# EAGLE schematic TDA7419 (EAGLE 7.5.0)
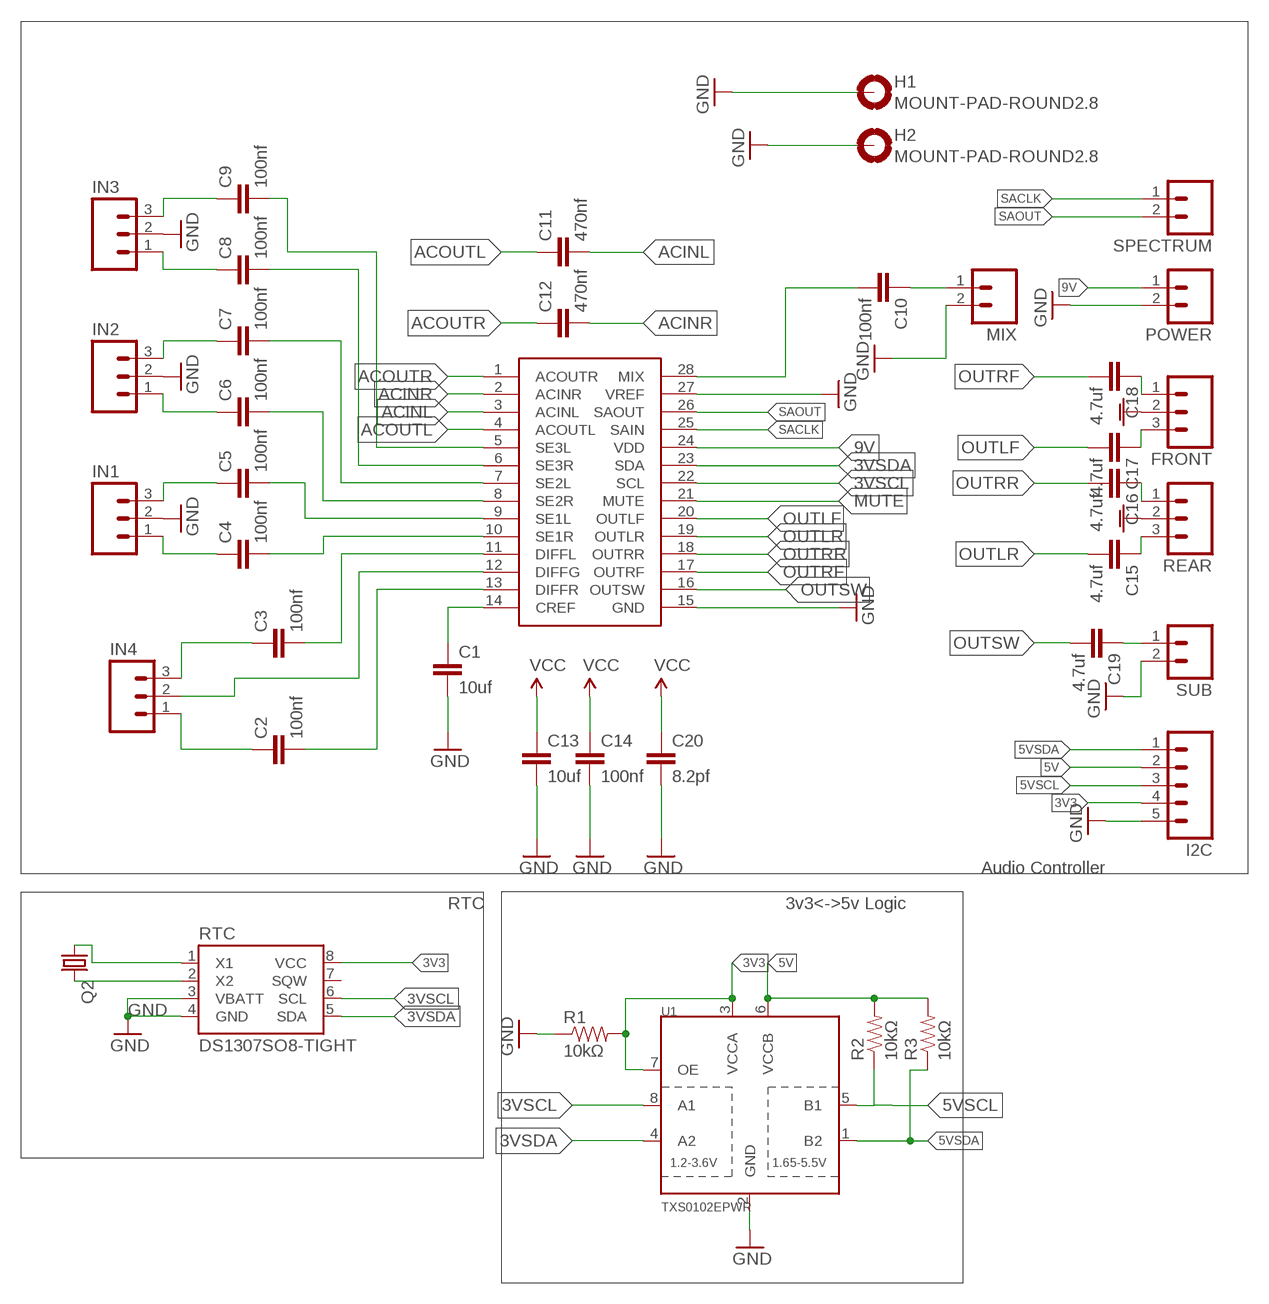
[diagram p0: schematic, sheet 1]

## Parts
C1  10uf  0603CAP  [0603-CAP]
C2  100nf  0603CAP  [0603-CAP]
C3  100nf  0603CAP  [0603-CAP]
C4  100nf  0603CAP  [0603-CAP]
C5  100nf  0603CAP  [0603-CAP]
C6  100nf  0603CAP  [0603-CAP]
C7  100nf  0603CAP  [0603-CAP]
C8  100nf  0603CAP  [0603-CAP]
C9  100nf  0603CAP  [0603-CAP]
C10  100nf  0603CAP  [0603-CAP]
C11  470nf  0603CAP  [0603-CAP]
C12  470nf  0603CAP  [0603-CAP]
C13  10uf  0603CAP  [0603-CAP]
C14  100nf  0603CAP  [0603-CAP]
C15  4.7uf  0603CAP  [0603-CAP]
C16  4.7uf  0603CAP  [0603-CAP]
C17  4.7uf  0603CAP  [0603-CAP]
C18  4.7uf  0603CAP  [0603-CAP]
C19  4.7uf  0603CAP  [0603-CAP]
C20  8.2pf  0603CAP  [0603-CAP]
FRONT  M03PTH  [1X03]
H1  MOUNT-PAD-ROUND2.8  [2,8-PAD]
H2  MOUNT-PAD-ROUND2.8  [2,8-PAD]
I2C  M05  [05P]
IN1  M03  [03P]
IN2  M03  [03P]
IN3  M03  [03P]
IN4  M03  [03P]
MIX  M02  [02P]
POWER  M02  [02P]
Q2  CRYSTALTC26H_EZ  [TC26HEZ]
R1  10kΩ  RESISTOR0603  [0603-RES]
R2  10kΩ  RESISTOR0603  [0603-RES]
R3  10kΩ  RESISTOR0603  [0603-RES]
REAR  M03PTH  [1X03]
RTC  DS1307SO8-TIGHT  [SO08-TIGHT]
SPECTRUM  M02  [02P]
SUB  M02  [02P]
TDA  TDA7419  [SOIC-28]
U1  TXS0102EPWR  [TSSOP8]

## Nets
3V3: I2C.4 R1.2 RTC.8(VCC) U1.3(VCCA) U1.7(OE)
3VSCL: RTC.6(SCL) TDA.22(SCL) U1.8(A1)
3VSDA: RTC.5(SDA) TDA.23(SDA) U1.4(A2)
5V: I2C.2 R2.2 R3.2 U1.6(VCCB)
5VSCL: I2C.3 R2.1 U1.5(B1)
5VSDA: I2C.1 R3.1 U1.1(B2)
9V: C13.1 C14.1 C20.1 POWER.1 TDA.24(VDD) ; supply symbol labelled VCC
ACINL: C11.2 TDA.3(ACINL)
ACINR: C12.2 TDA.2(ACINR)
ACOUTL: C11.1 TDA.4(ACOUTL)
ACOUTR: C12.1 TDA.1(ACOUTR)
CREF: C1.1 TDA.14(CREF)
DIFFG: IN4.2 TDA.12(DIFFG)
DIFFL: C3.2 TDA.11(DIFFL)
DIFFR: C2.2 TDA.13(DIFFR)
GND: C1.2 C13.2 C14.2 C20.2 FRONT.2 H1.B2,8(MOUNT) H2.B2,8(MOUNT) I2C.5 IN1.2 IN2.2 IN3.2 MIX.2 POWER.2 R1.1 REAR.2 RTC.3(VBATT) RTC.4(GND) SUB.2 TDA.15(GND) TDA.27(VREF) U1.2(GND) ; supply symbol labelled AGND
MIX: C10.2 TDA.28(MIX)
MUTE: TDA.21(MUTE)
N$1: C10.1 MIX.1
N$4: C9.1 IN3.3
N$5: C8.1 IN3.1
N$6: C7.1 IN2.3
N$7: C6.1 IN2.1
N$8: C5.1 IN1.3
N$9: C4.1 IN1.1
N$10: C3.1 IN4.3
N$11: C2.1 IN4.1
N$17: C18.1 FRONT.1
N$18: C17.1 FRONT.3
N$19: C16.1 REAR.1
N$20: C15.1 REAR.3
N$21: C19.1 SUB.1
N$25: Q2.2 RTC.2(X2)
N$30: Q2.1 RTC.1(X1)
OUTLF: C17.2 TDA.20(OUTLF)
OUTLR: C15.2 TDA.19(OUTLR)
OUTRF: C18.2 TDA.17(OUTRF)
OUTRR: C16.2 TDA.18(OUTRR)
OUTSW: C19.2 TDA.16(OUTSW)
SACLK: SPECTRUM.1 TDA.25(SAIN)
SAOUT: SPECTRUM.2 TDA.26(SAOUT)
SE1L: C5.2 TDA.9(SE1L)
SE1R: C4.2 TDA.10(SE1R)
SE2L: C7.2 TDA.7(SE2L)
SE2R: C6.2 TDA.8(SE2R)
SE3L: C9.2 TDA.5(SE3L)
SE3R: C8.2 TDA.6(SE3R)
Unconnected: RTC.7(SQW)

## Notes on the sheet
- Audio Controller
- RTC | 3v3<->5v Logic

## Library data of the parts
C1-C20 = john:0603CAP
FRONT REAR = SparkFun-Connectors:M03: Header 3 Standard 3-pin 0.1" header. Use with straight break away headers (SKU : PRT-00116), right angle break away headers (PRT-00553), swiss pins (PRT-00743), machine pins (PRT-00117), and female headers (PRT-00115). Molex polarized connector foot print use with SKU : PRT-08232 with associated crimp pins and housings.
H1 H2 = holes:MOUNT-PAD-ROUND: MOUNTING PAD, round
I2C = con-amp-quick:M05: AMP QUICK CONNECTOR; OC_FARNELL: unknown; OC_NEWARK: unknown
IN1-IN4 = con-amp-quick:M03: AMP QUICK CONNECTOR; OC_FARNELL: unknown; OC_NEWARK: unknown
MIX POWER SPECTRUM SUB = con-amp-quick:M02: AMP QUICK CONNECTOR; OC_FARNELL: unknown; OC_NEWARK: unknown
Q2 = SparkFun-FreqCtrl:CRYSTAL: Various standard crystals. Proven footprints.
R1-R3 = john:RESISTOR: Resistor Basic schematic elements and footprints for 0603, 1206, and PTH resistors.
RTC = SparkFun-FreqCtrl:DS1307: I2C real-time clock with battery backup.; PROD_ID: IC-08138
TDA = john:TDA7419
U1 = john:TXS0102EPWR